# Altium schematic sheet 5V_Switch.SchDoc
size A
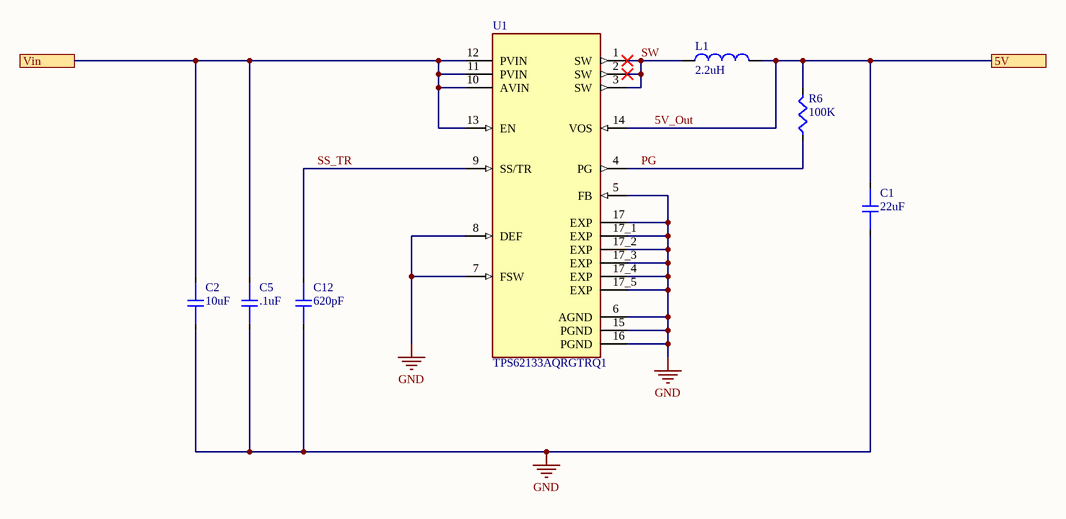
[diagram p0: 5V_Switch.SchDoc]

## Parts
C1  22uF  [C0603]
C2  10uF  [C0603]
C5  .1uF  [C0402]
C12  620pF  [C0402]
L1  2.2uH  [74438357022]
R6  100K  [C0402]
U1  TPS62133AQRGTRQ1  [QFN50P300X300X100-17N]

## Ports
5V, Vin

## Nets
GND: C1.1 C2.1 C5.1 C12.1 U1.5(FB) U1.6(AGND) U1.7(FSW) U1.8(DEF) U1.15(PGND) U1.16(PGND) U1.17(EXP) U1.17_1(EXP) U1.17_2(EXP) U1.17_3(EXP) U1.17_4(EXP) U1.17_5(EXP)
5V_Out: C1.2 L1.2 R6.1 U1.14(VOS) ; port 5V
PG: R6.2 U1.4(PG)
SS_TR: C12.2 U1.9(SS/TR)
SW: L1.1 U1.1(SW) U1.2(SW) U1.3(SW)
Vin: C2.2 C5.2 U1.10(AVIN) U1.11(PVIN) U1.12(PVIN) U1.13(EN) ; port Vin

## Library data of the parts
C1 = C1608X5R1A226M080AC: CAP CER 22UF 10V X5R 0603; Manufacturer 1: TDK; Dielectric Material: Ceramic; Capacitance: 10uF; Tolerance: 20%; Voltage Rating: 25V; RoHS: Yes; Mount: Surface Mount; Case/Package: 0603; Weight: 7.1E-05oz; Case Code (Imperial): 0603; Case Code (Metric): 1608; Min Operating Temperature: -55°C; Max Operating Temperature: 85°C; Packaging: Tape and Reel; Termination: SMD/SMT; Voltage Rating (DC): 25V; Composition: Ceramic; Dielectric: X5R; Package Quantity: 1; Length: 1.6mm; Height: 0.8mm; Width: 0.8mm; Thickness: 0.039inch; Depth: 0.8mm; Lead Free: Lead Free; REACH SVHC: No SVHC; ComponentLink1URL: http://components.arrow.com/part/dataview/0323_06887183?src-supplier=Arrow+Europe; ComponentLink1Description: http://components.arrow.com/part/dataview/0323_06887183?src-supplier=Arrow+Europe; ComponentLink2URL: http://www.farnell.com/datasheets/2792994.pdf?src-supplier=Farnell; ComponentLink2Description: http://www.farnell.com/datasheets/2792994.pdf?src-supplier=Farnell; ComponentLink3URL: http://www.farnell.com/datasheets/2291921.pdf?src-supplier=Avnet; ComponentLink3Description: http://www.farnell.com/datasheets/2291921.pdf?src-supplier=Avnet; ComponentLink4URL: http://www.farnell.com/datasheets/2792994.pdf?src-supplier=Newark; ComponentLink4Description: http://www.farnell.com/datasheets/2792994.pdf?src-supplier=Newark; ComponentLink5URL: http://www.farnell.com/datasheets/2291921.pdf?src-supplier=Newark; ComponentLink5Description: http://www.farnell.com/datasheets/2291921.pdf?src-supplier=Newark; ComponentLink6URL: http://www.farnell.com/datasheets/2792994.pdf?src-supplier=Element14; ComponentLink6Description: http://www.farnell.com/datasheets/2792994.pdf?src-supplier=Element14; ComponentLink7URL: http://www.farnell.com/datasheets/1913358.pdf?src-supplier=Element14; ComponentLink7Description: http://www.farnell.com/datasheets/1913358.pdf?src-supplier=Element14; ComponentLink8URL: https://product.tdk.com/info/en/catalog/datasheets/mlcc_commercial_general_en.pdf?src-supplier=Digi-Key; ComponentLink8Description: https://product.tdk.com/info/en/catalog/datasheets/mlcc_commercial_general_en.pdf?src-supplier=Digi-Key; ComponentLink9URL: http://www.farnell.com/datasheets/2291921.pdf?src-supplier=RSComponents; ComponentLink9Description: http://www.farnell.com/datasheets/2291921.pdf?src-supplier=RSComponents; ComponentLink10URL: http://www.farnell.com/datasheets/2291921.pdf?src-supplier=Verical; ComponentLink10Description: http://www.farnell.com/datasheets/2291921.pdf?src-supplier=Verical; ComponentLink11URL: http://www.farnell.com/datasheets/2291921.pdf?src-supplier=Mouser; ComponentLink11Description: http://www.farnell.com/datasheets/2291921.pdf?src-supplier=Mouser; ComponentLink12URL: http://www.farnell.com/datasheets/2291921.pdf?src-supplier=Quest; ComponentLink12Description: http://www.farnell.com/datasheets/2291921.pdf?src-supplier=Quest; ComponentLink13URL: http://www.farnell.com/datasheets/2291921.pdf?src-supplier=TTI; ComponentLink13Description: http://www.farnell.com/datasheets/2291921.pdf?src-supplier=TTI; Supplier 1: Digi-Key; Supplier Part Number 1: 445-9077-6-ND; Manufacturer Part Number 1: C1608X5R1A226M080AC; Stock 1: 310014; Pricing 1: 1=0.50000, 10=0.35100, 100=0.23120, 500=0.17122, 1000=0.14554 (USD); ComponentLink14URL: https://datasheet.ciiva.com/6274/tdkmlcccaprange-6274859.pdf?src-supplier=Digi-Key; ComponentLink14Description: https://datasheet.ciiva.com/6274/tdkmlcccaprange-6274859.pdf?src-supplier=Digi-Key; ComponentLink15URL: https://datasheet.ciiva.com/6274/tdkmlcccaprange-6274860.pdf?src-supplier=Digi-Key; ComponentLink15Description: https://datasheet.ciiva.com/6274/tdkmlcccaprange-6274860.pdf?src-supplier=Digi-Key; ComponentLink16URL: https://datasheet.ciiva.com/6274/tdkmlcccaprange-6274861.pdf?src-supplier=Digi-Key; ComponentLink16Description: https://datasheet.ciiva.com/6274/tdkmlcccaprange-6274861.pdf?src-supplier=Digi-Key; ComponentLink17URL: https://datasheet.ciiva.com/24216/mlcc-commercial-general-en-24216575.pdf?src-supplier=Mouser; ComponentLink17Description: https://datasheet.ciiva.com/24216/mlcc-commercial-general-en-24216575.pdf?src-supplier=Mouser
C2 = C1608X5R1E106M080AC: CAP CER 10UF 25V X5R 0603; Manufacturer 1: TDK; Dielectric Material: Ceramic; Tolerance: 20%; Supplier 1: Digi-Key; Supplier Part Number 1: 445-9015-1-ND; Manufacturer Part Number 1: C1608X5R1E106M080AC; Stock 1: 307531; Pricing 1: 1=0.84000, 10=0.62000, 100=0.42500, 500=0.33650, 1000=0.28336 (USD); RoHS: Yes; Mount: Surface Mount; Case/Package: 0603; Weight: 7.1E-05oz; Case Code (Imperial): 0603; Case Code (Metric): 1608; Min Operating Temperature: -55°C; Max Operating Temperature: 85°C; Capacitance: 10uF; Packaging: Tape and Reel; Voltage Rating: 25V; Termination: SMD/SMT; Voltage Rating (DC): 25V; Composition: Ceramic; Dielectric: X5R; Package Quantity: 1; Length: 1.6mm; Height: 0.8mm; Width: 0.8mm; Thickness: 0.039inch; Depth: 0.8mm; Lead Free: Lead Free; REACH SVHC: No SVHC; ComponentLink1URL: http://components.arrow.com/part/dataview/0323_06887183?src-supplier=Arrow+Europe; ComponentLink1Description: http://components.arrow.com/part/dataview/0323_06887183?src-supplier=Arrow+Europe; ComponentLink2URL: http://www.farnell.com/datasheets/2792994.pdf?src-supplier=Farnell; ComponentLink2Description: http://www.farnell.com/datasheets/2792994.pdf?src-supplier=Farnell; ComponentLink3URL: http://www.farnell.com/datasheets/2291921.pdf?src-supplier=Avnet; ComponentLink3Description: http://www.farnell.com/datasheets/2291921.pdf?src-supplier=Avnet; ComponentLink4URL: http://www.farnell.com/datasheets/2792994.pdf?src-supplier=Newark; ComponentLink4Description: http://www.farnell.com/datasheets/2792994.pdf?src-supplier=Newark; ComponentLink5URL: http://www.farnell.com/datasheets/2291921.pdf?src-supplier=Newark; ComponentLink5Description: http://www.farnell.com/datasheets/2291921.pdf?src-supplier=Newark; ComponentLink6URL: http://www.farnell.com/datasheets/2792994.pdf?src-supplier=Element14; ComponentLink6Description: http://www.farnell.com/datasheets/2792994.pdf?src-supplier=Element14; ComponentLink7URL: http://www.farnell.com/datasheets/1913358.pdf?src-supplier=Element14; ComponentLink7Description: http://www.farnell.com/datasheets/1913358.pdf?src-supplier=Element14; ComponentLink8URL: https://product.tdk.com/info/en/catalog/datasheets/mlcc_commercial_general_en.pdf?src-supplier=Digi-Key; ComponentLink8Description: https://product.tdk.com/info/en/catalog/datasheets/mlcc_commercial_general_en.pdf?src-supplier=Digi-Key; ComponentLink9URL: http://www.farnell.com/datasheets/2291921.pdf?src-supplier=RSComponents; ComponentLink9Description: http://www.farnell.com/datasheets/2291921.pdf?src-supplier=RSComponents; ComponentLink10URL: http://www.farnell.com/datasheets/2291921.pdf?src-supplier=Verical; ComponentLink10Description: http://www.farnell.com/datasheets/2291921.pdf?src-supplier=Verical; ComponentLink11URL: http://www.farnell.com/datasheets/2291921.pdf?src-supplier=Mouser; ComponentLink11Description: http://www.farnell.com/datasheets/2291921.pdf?src-supplier=Mouser; ComponentLink12URL: http://www.farnell.com/datasheets/2291921.pdf?src-supplier=Quest; ComponentLink12Description: http://www.farnell.com/datasheets/2291921.pdf?src-supplier=Quest; ComponentLink13URL: http://www.farnell.com/datasheets/2291921.pdf?src-supplier=TTI; ComponentLink13Description: http://www.farnell.com/datasheets/2291921.pdf?src-supplier=TTI
C5 = GRM155R71C104KA88D: CAP CER 0.1UF 16V X7R 0402; Dielectric Material: Ceramic; Capacitance: 10uF; Tolerance: 20%; Voltage Rating: 25V; Dielectric: X5R; RoHS: Yes; Mount: Surface Mount; Case/Package: 0603; Weight: 7.1E-05oz; Case Code (Imperial): 0603; Case Code (Metric): 1608; Min Operating Temperature: -55°C; Max Operating Temperature: 85°C; Packaging: Tape and Reel; Termination: SMD/SMT; Voltage Rating (DC): 25V; Composition: Ceramic; Package Quantity: 1; Length: 1.6mm; Height: 0.8mm; Width: 0.8mm; Thickness: 0.039inch; Depth: 0.8mm; Lead Free: Lead Free; REACH SVHC: No SVHC; ComponentLink1URL: http://components.arrow.com/part/dataview/0323_06887183?src-supplier=Arrow+Europe; ComponentLink1Description: http://components.arrow.com/part/dataview/0323_06887183?src-supplier=Arrow+Europe; ComponentLink2URL: http://www.farnell.com/datasheets/2792994.pdf?src-supplier=Farnell; ComponentLink2Description: http://www.farnell.com/datasheets/2792994.pdf?src-supplier=Farnell; ComponentLink3URL: http://www.farnell.com/datasheets/2291921.pdf?src-supplier=Avnet; ComponentLink3Description: http://www.farnell.com/datasheets/2291921.pdf?src-supplier=Avnet; ComponentLink4URL: http://www.farnell.com/datasheets/2792994.pdf?src-supplier=Newark; ComponentLink4Description: http://www.farnell.com/datasheets/2792994.pdf?src-supplier=Newark; ComponentLink5URL: http://www.farnell.com/datasheets/2291921.pdf?src-supplier=Newark; ComponentLink5Description: http://www.farnell.com/datasheets/2291921.pdf?src-supplier=Newark; ComponentLink6URL: http://www.farnell.com/datasheets/2792994.pdf?src-supplier=Element14; ComponentLink6Description: http://www.farnell.com/datasheets/2792994.pdf?src-supplier=Element14; ComponentLink7URL: http://www.farnell.com/datasheets/1913358.pdf?src-supplier=Element14; ComponentLink7Description: http://www.farnell.com/datasheets/1913358.pdf?src-supplier=Element14; ComponentLink8URL: https://product.tdk.com/info/en/catalog/datasheets/mlcc_commercial_general_en.pdf?src-supplier=Digi-Key; ComponentLink8Description: https://product.tdk.com/info/en/catalog/datasheets/mlcc_commercial_general_en.pdf?src-supplier=Digi-Key; ComponentLink9URL: http://www.farnell.com/datasheets/2291921.pdf?src-supplier=RSComponents; ComponentLink9Description: http://www.farnell.com/datasheets/2291921.pdf?src-supplier=RSComponents; ComponentLink10URL: http://www.farnell.com/datasheets/2291921.pdf?src-supplier=Verical; ComponentLink10Description: http://www.farnell.com/datasheets/2291921.pdf?src-supplier=Verical; ComponentLink11URL: http://www.farnell.com/datasheets/2291921.pdf?src-supplier=Mouser; ComponentLink11Description: http://www.farnell.com/datasheets/2291921.pdf?src-supplier=Mouser; ComponentLink12URL: http://www.farnell.com/datasheets/2291921.pdf?src-supplier=Quest; ComponentLink12Description: http://www.farnell.com/datasheets/2291921.pdf?src-supplier=Quest; ComponentLink13URL: http://www.farnell.com/datasheets/2291921.pdf?src-supplier=TTI; ComponentLink13Description: http://www.farnell.com/datasheets/2291921.pdf?src-supplier=TTI; Supplier 1: Digi-Key; Supplier Part Number 1: 490-3261-6-ND
C12 = GRM1555C1E621JA01D: CAP CER 620PF 25V C0G/NP0 0402; Dielectric Material: Ceramic; Capacitance: 10uF; Tolerance: 20%; Dielectric: X5R; RoHS: Yes; Mount: Surface Mount; Case/Package: 0603; Weight: 7.1E-05oz; Case Code (Imperial): 0603; Case Code (Metric): 1608; Min Operating Temperature: -55°C; Max Operating Temperature: 85°C; Packaging: Tape and Reel; Voltage Rating: 25V; Termination: SMD/SMT; Voltage Rating (DC): 25V; Composition: Ceramic; Package Quantity: 1; Length: 1.6mm; Height: 0.8mm; Width: 0.8mm; Thickness: 0.039inch; Depth: 0.8mm; Lead Free: Lead Free; REACH SVHC: No SVHC; ComponentLink1URL: http://components.arrow.com/part/dataview/0323_06887183?src-supplier=Arrow+Europe; ComponentLink1Description: http://components.arrow.com/part/dataview/0323_06887183?src-supplier=Arrow+Europe; ComponentLink2URL: http://www.farnell.com/datasheets/2792994.pdf?src-supplier=Farnell; ComponentLink2Description: http://www.farnell.com/datasheets/2792994.pdf?src-supplier=Farnell; ComponentLink3URL: http://www.farnell.com/datasheets/2291921.pdf?src-supplier=Avnet; ComponentLink3Description: http://www.farnell.com/datasheets/2291921.pdf?src-supplier=Avnet; ComponentLink4URL: http://www.farnell.com/datasheets/2792994.pdf?src-supplier=Newark; ComponentLink4Description: http://www.farnell.com/datasheets/2792994.pdf?src-supplier=Newark; ComponentLink5URL: http://www.farnell.com/datasheets/2291921.pdf?src-supplier=Newark; ComponentLink5Description: http://www.farnell.com/datasheets/2291921.pdf?src-supplier=Newark; ComponentLink6URL: http://www.farnell.com/datasheets/2792994.pdf?src-supplier=Element14; ComponentLink6Description: http://www.farnell.com/datasheets/2792994.pdf?src-supplier=Element14; ComponentLink7URL: http://www.farnell.com/datasheets/1913358.pdf?src-supplier=Element14; ComponentLink7Description: http://www.farnell.com/datasheets/1913358.pdf?src-supplier=Element14; ComponentLink8URL: https://product.tdk.com/info/en/catalog/datasheets/mlcc_commercial_general_en.pdf?src-supplier=Digi-Key; ComponentLink8Description: https://product.tdk.com/info/en/catalog/datasheets/mlcc_commercial_general_en.pdf?src-supplier=Digi-Key; ComponentLink9URL: http://www.farnell.com/datasheets/2291921.pdf?src-supplier=RSComponents; ComponentLink9Description: http://www.farnell.com/datasheets/2291921.pdf?src-supplier=RSComponents; ComponentLink10URL: http://www.farnell.com/datasheets/2291921.pdf?src-supplier=Verical; ComponentLink10Description: http://www.farnell.com/datasheets/2291921.pdf?src-supplier=Verical; ComponentLink11URL: http://www.farnell.com/datasheets/2291921.pdf?src-supplier=Mouser; ComponentLink11Description: http://www.farnell.com/datasheets/2291921.pdf?src-supplier=Mouser; ComponentLink12URL: http://www.farnell.com/datasheets/2291921.pdf?src-supplier=Quest; ComponentLink12Description: http://www.farnell.com/datasheets/2291921.pdf?src-supplier=Quest; ComponentLink13URL: http://www.farnell.com/datasheets/2291921.pdf?src-supplier=TTI; ComponentLink13Description: http://www.farnell.com/datasheets/2291921.pdf?src-supplier=TTI; Supplier 1: Digi-Key; Supplier Part Number 1: 490-6181-1-ND
L1 = 74438357022: INDUCTOR, 2.2UH, 5.2A, 20%, SHIELDED; Manufacturer 1: Wurth Electronics; Core Material: Metal,Composite; Saturation Current: 7A; DC Resistance (DCR): 26mR; Self Resonant Frequency: 35MHz; Test Frequency: 100kHz; Supplier 1: Digi-Key; Supplier Part Number 1: 732-11201-1-ND; Manufacturer Part Number 1: 74438357022; Stock 1: 1686; Pricing 1: 1=1.58000, 10=1.50700, 50=1.45200, 100=1.32000 (USD); RoHS: No; Mount: Surface Mount; Case/Package: Nonstandard; Min Operating Temperature: -40°C; Max Operating Temperature: 125°C; Packaging: Cut Tape; Inductance: 2.2uH; Tolerance: 20%; Current Rating: 5.2A; Shielding: Shielded; ComponentLink1URL: http://www.farnell.com/datasheets/2579569.pdf?src-supplier=Farnell; ComponentLink1Description: http://www.farnell.com/datasheets/2579569.pdf?src-supplier=Farnell; ComponentLink2URL: https://katalog.we-online.de/pbs/datasheet/74438357022.pdf?src-supplier=Digi-Key; ComponentLink2Description: https://katalog.we-online.de/pbs/datasheet/74438357022.pdf?src-supplier=Digi-Key; ComponentLink3URL: http://www.farnell.com/datasheets/2579569.pdf?src-supplier=Newark; ComponentLink3Description: http://www.farnell.com/datasheets/2579569.pdf?src-supplier=Newark
R6 = CRCW0402100KFKED: RES SMD 100K OHM 1% 1/16W 0402; Tolerance: 20%; Voltage Rating: 25V; Dielectric Material: Ceramic; Capacitance: 10uF; Dielectric: X5R; RoHS: Yes; Mount: Surface Mount; Case/Package: 0603; Weight: 7.1E-05oz; Case Code (Metric): 1608; Case Code (Imperial): 0603; Min Operating Temperature: -55°C; Max Operating Temperature: 85°C; Composition: Ceramic; Termination: SMD/SMT; Packaging: Tape and Reel; Package Quantity: 1; Voltage Rating (DC): 25V; Length: 1.6mm; Height: 0.8mm; Depth: 0.8mm; Width: 0.8mm; Lead Free: Lead Free; REACH SVHC: No SVHC; ComponentLink1URL: http://components.arrow.com/part/dataview/0323_06887183?src-supplier=Arrow+Europe; ComponentLink1Description: http://components.arrow.com/part/dataview/0323_06887183?src-supplier=Arrow+Europe; ComponentLink2URL: http://www.farnell.com/datasheets/2792994.pdf?src-supplier=Farnell; ComponentLink2Description: http://www.farnell.com/datasheets/2792994.pdf?src-supplier=Farnell; ComponentLink3URL: http://www.farnell.com/datasheets/2291921.pdf?src-supplier=Avnet; ComponentLink3Description: http://www.farnell.com/datasheets/2291921.pdf?src-supplier=Avnet; ComponentLink4URL: http://www.farnell.com/datasheets/2792994.pdf?src-supplier=Newark; ComponentLink4Description: http://www.farnell.com/datasheets/2792994.pdf?src-supplier=Newark; ComponentLink5URL: http://www.farnell.com/datasheets/2291921.pdf?src-supplier=Newark; ComponentLink5Description: http://www.farnell.com/datasheets/2291921.pdf?src-supplier=Newark; ComponentLink6URL: http://www.farnell.com/datasheets/2792994.pdf?src-supplier=Element14; ComponentLink6Description: http://www.farnell.com/datasheets/2792994.pdf?src-supplier=Element14; ComponentLink7URL: http://www.farnell.com/datasheets/1913358.pdf?src-supplier=Element14; ComponentLink7Description: http://www.farnell.com/datasheets/1913358.pdf?src-supplier=Element14; ComponentLink8URL: https://product.tdk.com/info/en/catalog/datasheets/mlcc_commercial_general_en.pdf?src-supplier=Digi-Key; ComponentLink8Description: https://product.tdk.com/info/en/catalog/datasheets/mlcc_commercial_general_en.pdf?src-supplier=Digi-Key; ComponentLink9URL: http://www.farnell.com/datasheets/2291921.pdf?src-supplier=RSComponents; ComponentLink9Description: http://www.farnell.com/datasheets/2291921.pdf?src-supplier=RSComponents; ComponentLink10URL: http://www.farnell.com/datasheets/2291921.pdf?src-supplier=Verical; ComponentLink10Description: http://www.farnell.com/datasheets/2291921.pdf?src-supplier=Verical; ComponentLink11URL: http://www.farnell.com/datasheets/2291921.pdf?src-supplier=Mouser; ComponentLink11Description: http://www.farnell.com/datasheets/2291921.pdf?src-supplier=Mouser; ComponentLink12URL: http://www.farnell.com/datasheets/2291921.pdf?src-supplier=Quest; ComponentLink12Description: http://www.farnell.com/datasheets/2291921.pdf?src-supplier=Quest; Thickness: 0.039inch; ComponentLink13URL: http://www.farnell.com/datasheets/2291921.pdf?src-supplier=TTI; ComponentLink13Description: http://www.farnell.com/datasheets/2291921.pdf?src-supplier=TTI; Supplier 1: Digi-Key; Supplier Part Number 1: 541-100KLDKR-ND
U1 = TPS62133AQRGTRQ1: Buck Switching Regulator IC Positive Fixed 5V 1 Output 3A 16-VFQFN Exposed Pad; MF: Texas Instruments; Value: *; SnapEDA_Link: https://www.snapeda.com/parts/TPS62133AQRGTRQ1/Texas%20Instruments/view-part/454614/?ref=snap; Price: None; Availability: Unavailable; Package: VQFN-16 Texas Instruments; MP: TPS62133AQRGTRQ1; Supplier 1: Digi-Key; Supplier Part Number 1: 296-40835-1-ND